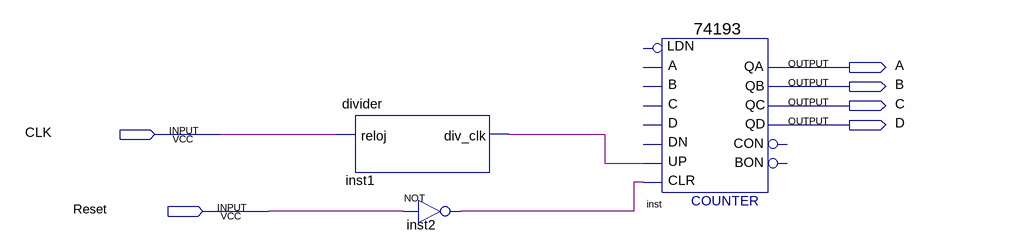
[diagram p0: schematic sheet]
// Quartus schematic practica1.bdf as structural Verilog: 3 symbols, 6 pins
module practica1 (
  input  CLK,
  input  Reset,
  output A,
  output B,
  output C,
  output D
);

  wire inst1_div_clk, inst2_out;

  divider inst1 (.reloj(CLK), .div_clk(inst1_div_clk));
  not inst2 (inst2_out, Reset);
  \74193  inst (
    .CLR(inst2_out), .UP(inst1_div_clk), .QB(B), .QA(A), .QD(D), .QC(C));  // open: D, C, B, A, DN, LDN, CON, BON
endmodule
